# EAGLE board csa_vdc_v1.4a (EAGLE 4.15), part 1 of 2
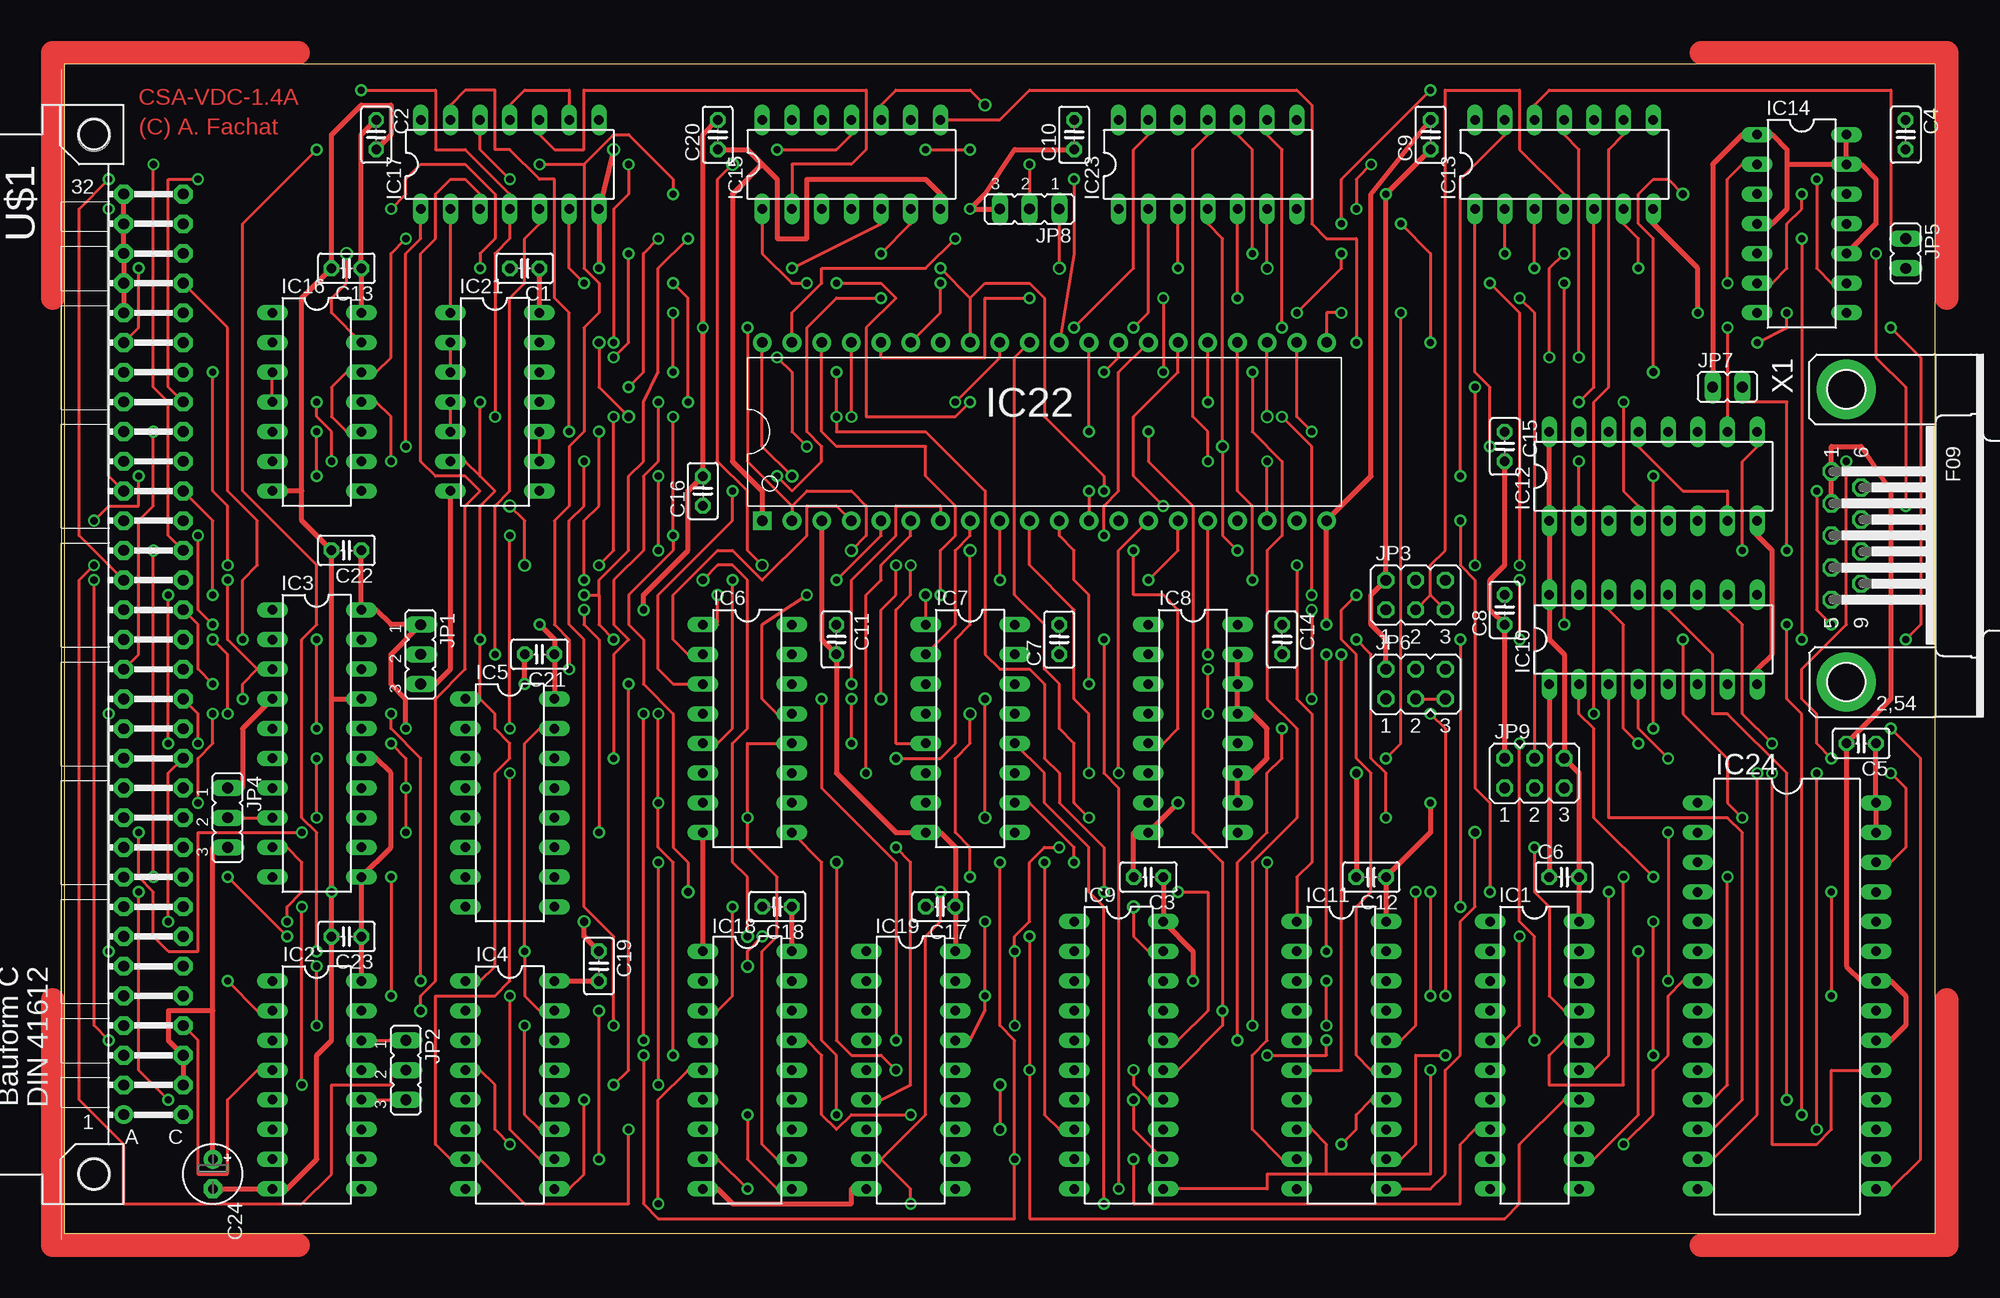
[diagram p1: board, top side]
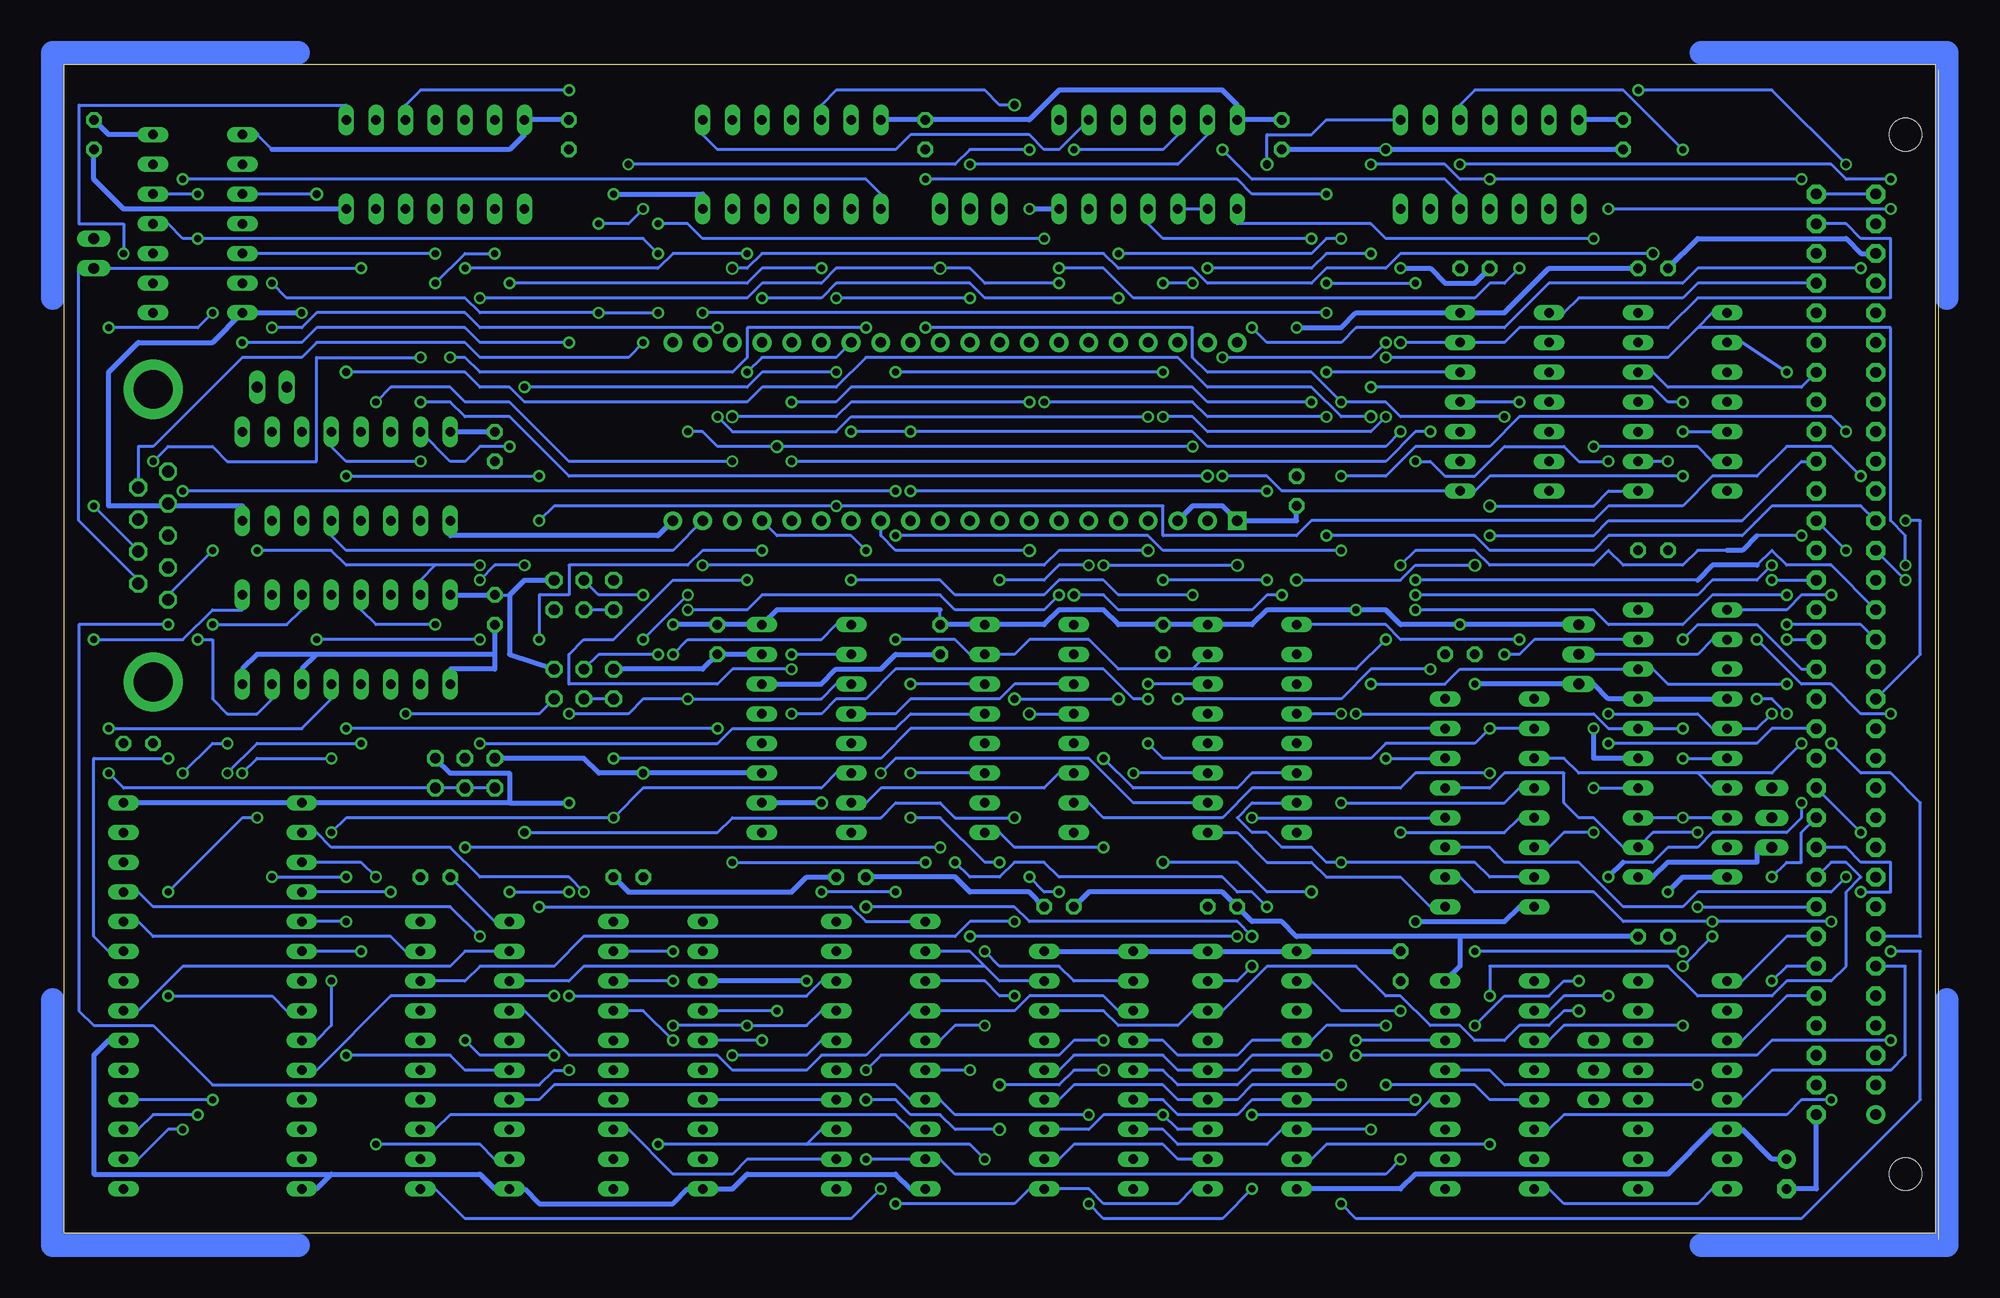
[diagram p2: board, bottom side, seen from below]

Size 160 x 100 mm. Coordinates in mm from the lower left corner, seen from the top.
Outline: 0,0 160,0 160,100 0,100 0,0
Copper layers (1*16): Top 0.035mm / dielectric 1.5mm / Bottom 0.035mm
Design rules "default": minimum track width 10mil, minimum drill 24mil, track to track 8mil, track to pad 8mil, pad to pad 8mil, via to via 8mil, smd to smd 8mil, copper to edge 40mil, drill to drill 8mil, minimum pad ring 10mil, minimum via ring 8mil, stop-mask expansion 4mil, vias tented up to drill 0mil, thermal gap 10mil

## Footprints (pad centres in the part's own frame; a part is rotated, then mirrored left to right if it is on the bottom)
C025-025X050 = drill 0.813 octagon: 1 -1.27,0; 2 1.27,0
E2,5-5 = drill 0.813 pad 1.6 round: + -1.27,0 | drill 0.813 pad 1.6 octagon: - 1.27,0
DIL20 = drill 0.813 long: 1 -11.43,-3.81; 2 -8.89,-3.81; 3 -6.35,-3.81; 4 -3.81,-3.81; 5 -1.27,-3.81; 6 1.27,-3.81; 7 3.81,-3.81; 8 6.35,-3.81; 9 8.89,-3.81; 10 11.43,-3.81; 11 11.43,3.81; 12 8.89,3.81; 13 6.35,3.81; 14 3.81,3.81; 15 1.27,3.81; 16 -1.27,3.81; 17 -3.81,3.81; 18 -6.35,3.81; 19 -8.89,3.81; 20 -11.43,3.81
DIL16 = drill 0.813 long: 1 -8.89,-3.81; 2 -6.35,-3.81; 3 -3.81,-3.81; 4 -1.27,-3.81; 5 1.27,-3.81; 6 3.81,-3.81; 7 6.35,-3.81; 8 8.89,-3.81; 9 8.89,3.81; 10 6.35,3.81; 11 3.81,3.81; 12 1.27,3.81; 13 -1.27,3.81; 14 -3.81,3.81; 15 -6.35,3.81; 16 -8.89,3.81
DIL20' = drill 0.813 long: 1 -10.16,-3.81; 2 -7.62,-3.81; 3 -5.08,-3.81; 4 -2.54,-3.81; 5 0,-3.81; 6 2.54,-3.81; 7 5.08,-3.81; 8 7.62,-3.81; 9 10.16,-3.81; 10 12.7,-3.81; 11 12.7,3.81; 12 10.16,3.81; 13 7.62,3.81; 14 5.08,3.81; 15 2.54,3.81; 16 0,3.81; 17 -2.54,3.81; 18 -5.08,3.81; 19 -7.62,3.81; 20 -10.16,3.81
DIL14 = drill 0.813 long: 1 -7.62,-3.81; 2 -5.08,-3.81; 3 -2.54,-3.81; 4 0,-3.81; 5 2.54,-3.81; 6 5.08,-3.81; 7 7.62,-3.81; 8 7.62,3.81; 9 5.08,3.81; 10 2.54,3.81; 11 0,3.81; 12 -2.54,3.81; 13 -5.08,3.81; 14 -7.62,3.81
DIL18 = drill 0.813 long: 1 -10.16,-3.81; 2 -7.62,-3.81; 3 -5.08,-3.81; 4 -2.54,-3.81; 5 0,-3.81; 6 2.54,-3.81; 7 5.08,-3.81; 8 7.62,-3.81; 9 10.16,-3.81; 10 10.16,3.81; 11 7.62,3.81; 12 5.08,3.81; 13 2.54,3.81; 14 0,3.81; 15 -2.54,3.81; 16 -5.08,3.81; 17 -7.62,3.81; 18 -10.16,3.81
DIP40 = drill 0.889 pad 1.6 square: 1 -24.13,-7.62 | drill 0.889 pad 1.6 round: 2 -21.59,-7.62; 3 -19.05,-7.62; 4 -16.51,-7.62; 5 -13.97,-7.62; 6 -11.43,-7.62; 7 -8.89,-7.62; 8 -6.35,-7.62; 9 -3.81,-7.62; 10 -1.27,-7.62; 11 1.27,-7.62; 12 3.81,-7.62; 13 6.35,-7.62; 14 8.89,-7.62; 15 11.43,-7.62; 16 13.97,-7.62; 17 16.51,-7.62; 18 19.05,-7.62; 19 21.59,-7.62; 20 24.13,-7.62; 21 24.13,7.62; 22 21.59,7.62; 23 19.05,7.62; 24 16.51,7.62; 25 13.97,7.62; 26 11.43,7.62; 27 8.89,7.62; 28 6.35,7.62; 29 3.81,7.62; 30 1.27,7.62; 31 -1.27,7.62; 32 -3.81,7.62; 33 -6.35,7.62; 34 -8.89,7.62; 35 -11.43,7.62; 36 -13.97,7.62; 37 -16.51,7.62; 38 -19.05,7.62; 39 -21.59,7.62; 40 -24.13,7.62
DIL28-6 = drill 0.813 long: 1 -16.51,-7.62; 2 -13.97,-7.62; 3 -11.43,-7.62; 4 -8.89,-7.62; 5 -6.35,-7.62; 6 -3.81,-7.62; 7 -1.27,-7.62; 8 1.27,-7.62; 9 3.81,-7.62; 10 6.35,-7.62; 11 8.89,-7.62; 12 11.43,-7.62; 13 13.97,-7.62; 14 16.51,-7.62; 15 16.51,7.62; 16 13.97,7.62; 17 11.43,7.62; 18 8.89,7.62; 19 6.35,7.62; 20 3.81,7.62; 21 1.27,7.62; 22 -1.27,7.62; 23 -3.81,7.62; 24 -6.35,7.62; 25 -8.89,7.62; 26 -11.43,7.62; 27 -13.97,7.62; 28 -16.51,7.62
JP2 = drill 0.914 long: 1 -2.54,0; 2 0,0; 3 2.54,0
JP3Q = drill 0.914 octagon: 1 -2.54,-1.27; 2 -2.54,1.27; 3 0,-1.27; 4 0,1.27; 5 2.54,-1.27; 6 2.54,1.27
JP1 = drill 0.914 long: 1 0,-1.27; 2 0,1.27
CSABUS = drill 0.914 pad 1.6 round: A1 7.62,36.83 | drill 0.914 pad 1.6 octagon: A2 7.62,34.29; A3 7.62,31.75; A4 7.62,29.21; A5 7.62,26.67; A6 7.62,24.13; A7 7.62,21.59; A8 7.62,19.05; A9 7.62,16.51; A10 7.62,13.97; A11 7.62,11.43; A12 7.62,8.89; A13 7.62,6.35; A14 7.62,3.81; A15 7.62,1.27; A16 7.62,-1.27; A17 7.62,-3.81; A18 7.62,-6.35; A19 7.62,-8.89; A20 7.62,-11.43; A21 7.62,-13.97; A22 7.62,-16.51; A23 7.62,-19.05; A24 7.62,-21.59; A25 7.62,-24.13; A26 7.62,-26.67; A27 7.62,-29.21; A28 7.62,-31.75; A29 7.62,-34.29; A30 7.62,-36.83; A31 7.62,-39.37; A32 7.62,-41.91; C1 2.54,36.83; C2 2.54,34.29; C3 2.54,31.75; C4 2.54,29.21; C5 2.54,26.67; C6 2.54,24.13; C7 2.54,21.59; C8 2.54,19.05; C9 2.54,16.51; C10 2.54,13.97; C11 2.54,11.43; C12 2.54,8.89; C13 2.54,6.35; C14 2.54,3.81; C15 2.54,1.27; C16 2.54,-1.27; C17 2.54,-3.81; C18 2.54,-6.35; C19 2.54,-8.89; C20 2.54,-11.43; C21 2.54,-13.97; C22 2.54,-16.51; C23 2.54,-19.05; C24 2.54,-21.59; C25 2.54,-24.13; C26 2.54,-26.67; C27 2.54,-29.21; C28 2.54,-31.75; C29 2.54,-34.29; C30 2.54,-36.83; C31 2.54,-39.37; C32 2.54,-41.91 | hole 2.794: 10.16,41.91; 10.16,-46.99
F09HP = drill 1.016 octagon: 1 -5.486,-1.27; 2 -2.743,-1.27; 3 0,-1.27; 4 2.743,-1.27; 5 5.486,-1.27; 6 -4.115,1.27; 7 -1.372,1.27; 8 1.372,1.27; 9 4.115,1.27 | drill 3.302 pad 5.08 round: G1 -12.522,0; G2 12.522,0

## Placement (x,y rotation side)
C1  100n  [C025-025X050]  39.37,82.55 180 top
C2  100n  [C025-025X050]  26.67,93.98 270 top
C3  100n  [C025-025X050]  92.71,30.48 180 top
C4  100n  [C025-025X050]  157.48,93.98 270 top
C5  100n  [C025-025X050]  153.67,41.91 180 top
C6  100n  [C025-025X050]  128.27,30.48 0 top
C7  100n  [C025-025X050]  85.09,50.8 90 top
C8  100n  [C025-025X050]  123.19,53.34 90 top
C9  100n  [C025-025X050]  116.84,93.98 90 top
C10  100n  [C025-025X050]  86.36,93.98 90 top
C11  100n  [C025-025X050]  66.04,50.8 270 top
C12  100n  [C025-025X050]  111.76,30.48 180 top
C13  100n  [C025-025X050]  24.13,82.55 180 top
C14  100n  [C025-025X050]  104.14,50.8 270 top
C15  100n  [C025-025X050]  123.19,67.31 270 top
C16  100n  [C025-025X050]  54.61,63.5 90 top
C17  100n  [C025-025X050]  74.93,27.94 180 top
C18  100n  [C025-025X050]  60.96,27.94 180 top
C19  100n  [C025-025X050]  45.72,22.86 270 top
C20  100n  [C025-025X050]  55.88,93.98 90 top
C21  100n  [C025-025X050]  40.64,49.53 180 top
C22  100n  [C025-025X050]  24.13,58.42 180 top
C23  100n  [C025-025X050]  24.13,25.4 180 top
C24  47u  [E2,5-5]  12.7,5.08 270 top
IC1  74HC374N  [DIL20]  125.73,15.24 270 top
IC2  74HCT138N  [DIL16]  21.59,12.7 270 top
IC3  74LS688BUSOPT  [DIL20']  21.59,43.18 270 top
IC4  74HCT257N  [DIL16]  38.1,12.7 270 top
IC5  74HCT257N  [DIL16]  38.1,36.83 270 top
IC6  74HCT257N  [DIL16]  58.42,43.18 270 top
IC7  74HCT257N  [DIL16]  77.47,43.18 270 top
IC8  74HCT257N  [DIL16]  96.52,43.18 270 top
IC9  74HCT245N  [DIL20]  90.17,15.24 270 top
IC10  74HCT166N  [DIL16]  135.89,50.8 0 top
IC11  74LS273BUSOPT  [DIL20']  109.22,16.51 270 top
IC12  74HCT175N  [DIL16]  135.89,64.77 0 top
IC13  74LS86N  [DIL14]  128.27,91.44 0 top
IC14  74HCT74N  [DIL14]  148.59,86.36 270 top
IC15  74HCT04N  [DIL14]  67.31,91.44 0 top
IC16  74HCT00N  [DIL14]  21.59,71.12 270 top
IC17  74LS32N  [DIL14]  38.1,91.44 0 top
IC18  [DIL18]  58.42,13.97 270 top
IC19  [DIL18]  72.39,13.97 270 top
IC21  74HCT04N  [DIL14]  36.83,71.12 270 top
IC22  CRTC6545SMALLPADS  [DIP40]  83.82,68.58 0 top
IC23  74HCT00N  [DIL14]  97.79,91.44 0 top
IC24  27C128P  [DIL28-6]  147.32,20.32 270 top
JP1  [JP2]  30.48,49.53 270 top
JP2  [JP2]  29.21,13.97 270 top
JP3  [JP3Q]  115.57,54.61 0 top
JP4  [JP2]  13.97,35.56 270 top
JP5  [JP1]  157.48,83.82 180 top
JP6  [JP3Q]  115.57,46.99 0 top
JP7  [JP1]  142.24,72.39 270 top
JP8  [JP2]  82.55,87.63 180 top
JP9  [JP3Q]  125.73,39.37 0 top
U$1  CSABUS  [CSABUS]  12.7,46.99 180 top
X1  [F09HP]  152.4,59.69 270 top